# Altium schematic sheet MAX3232_simple.SchDoc
size A4
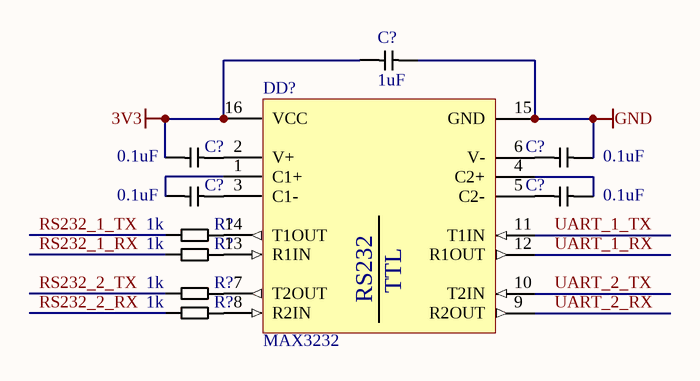
[diagram p0: MAX3232_simple.SchDoc]

## Parts
(Parts that share a designator on the sheet are numbered #1, #2 ... from top to bottom, then left to right.)
C?#1  1uF  [C0603]
C?#2  0.1uF  [C0603]
C?#3  0.1uF  [C0603]
C?#4  0.1uF  [C0603]
C?#5  0.1uF  [C0603]
DD?  MAX3232  [TSSOP-16]
R?#1  1k  [R0603]
R?#2  1k  [R0603]
R?#3  1k  [R0603]
R?#4  1k  [R0603]

## Nets
3V3: C?#1.1 C?#2.1 DD?.16(VCC)
GND: C?#1.2 C?#3.2 DD?.15(GND)
RS232_1_RX: R?#2.1
RS232_1_TX: R?#1.1
RS232_2_RX: R?#4.1
RS232_2_TX: R?#3.1
UART_1_RX: DD?.12(R1OUT)
UART_1_TX: DD?.11(T1IN)
UART_2_RX: DD?.9(R2OUT)
UART_2_TX: DD?.10(T2IN)
NetC?#2_2: C?#2.2 DD?.2(V+)
NetC?#3_1: C?#3.1 DD?.6(V-)
NetC?#4_1: C?#4.1 DD?.1(C1+)
NetC?#4_2: C?#4.2 DD?.3(C1-)
NetC?#5_1: C?#5.1 DD?.5(C2-)
NetC?#5_2: C?#5.2 DD?.4(C2+)
NetDD?_7: DD?.7(T2OUT) R?#3.2
NetDD?_8: DD?.8(R2IN) R?#4.2
NetDD?_13: DD?.13(R1IN) R?#2.2
NetDD?_14: DD?.14(T1OUT) R?#1.2

## Notes on the sheet
- (in symbol MAX3232) TTL; RS232

## Library data of the parts
C?#1-C?#5 = C: Capacitor
DD? = MAX3232: MAX3232 TTL/CMOS<-->RS-232
R?#1-R?#4 = R: Resistor